# Altium project DTTT_Project.PrjPcb
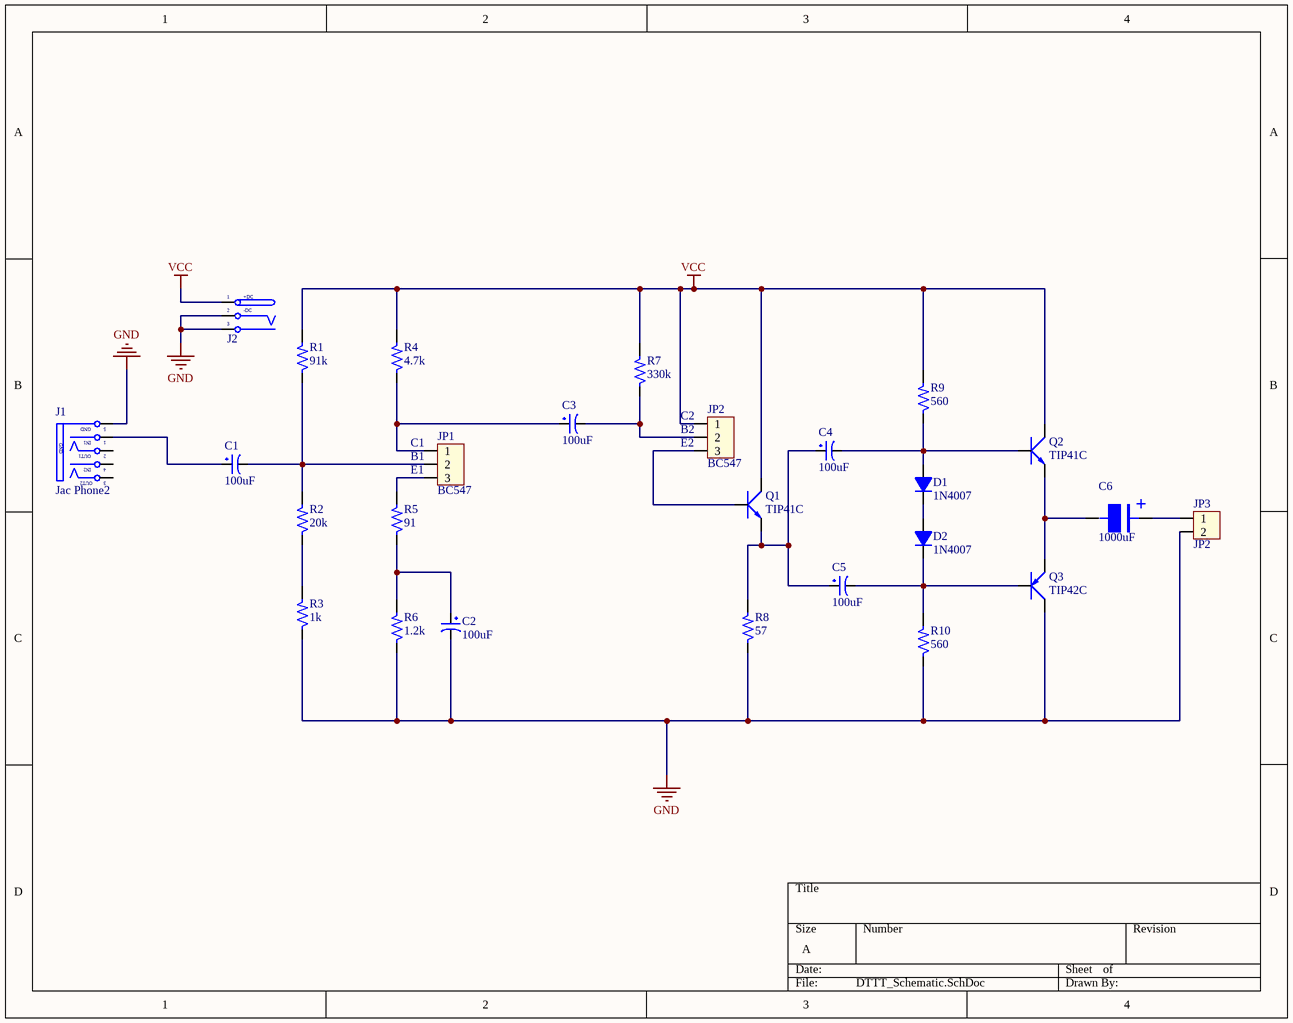
[diagram p0: DTTT_Schematic.SchDoc]
1 sheet, 26 parts. Net scope: global (net labels, ports and power ports of the same name join across sheets).
Board file: DTTT_PCB.PcbDoc

## Sheet DTTT_Schematic.SchDoc
size A; SheetNumber: 1; SheetTotal: 1

### Parts
C1  100uF  [CP1/2.5]
C2  100uF  [CP1/2.5]
C3  100uF  [CP1/2.5]
C4  100uF  [CP1/2.5]
C5  100uF  [CP1/2.5]
C6  1000uF  [CAP1000uF50V]
D1  1N4007  [D1A]
D2  1N4007  [D1A]
J1  Jac Phone2  [JacPhone2]
J2  JACK DC 5MM  [JACK DC 5MM]  (value not drawn)
JP1  BC547  [CON3]
JP2  BC547  [CON3]
JP3  JP2  [CON2]
Q1  TIP41C  [QTO-220]
Q2  TIP41C  [QTO-220]
Q3  TIP42C  [QTO-220]
R1  91k  [DIEN TRO 1/4 W]
R2  20k  [DIEN TRO 1/4 W]
R3  1k  [DIEN TRO 1/4 W]
R4  4.7k  [DIEN TRO 1/4 W]
R5  91  [DIEN TRO 1/4 W]
R6  1.2k  [DIEN TRO 1/4 W]
R7  330k  [DIEN TRO 1/4 W]
R8  57  [DIEN TRO 1/4 W]
R9  560  [DIEN TRO 1/4 W]
R10  560  [DIEN TRO 1/4 W]

### Nets
GND: C2.2 J1.5(GND) J2.2(TN) J2.3(S) JP3.2 Q3.2(C) R3.1 R6.1 R8.1 R10.1
VCC: J2.1(T) JP2.1 Q1.2(C) Q2.2(C) R1.2 R4.2 R7.2 R9.2
NetC1_1: C1.1 J1.1(S1)
NetC1_2: C1.2 JP1.2 R1.1 R2.2
NetC2_1: C2.1 R5.1 R6.2
NetC3_1: C3.1 JP1.1 R4.1
NetC3_2: C3.2 JP2.2 R7.1
NetC4_1: C4.1 C5.1 Q1.3(E) R8.2
NetC4_2: C4.2 D1.1(A) Q2.1(B) R9.1
NetC5_2: C5.2 D2.2(K) Q3.1(B) R10.2
NetC6_1: C6.1 JP3.1
NetC6_2: C6.2 Q2.3(E) Q3.3(E)
NetD1_2: D1.2(K) D2.1(A)
NetJP1_3: JP1.3 R5.2
NetJP2_3: JP2.3 Q1.1(B)
NetR2_1: R2.1 R3.2

Not connected (* = marked no-connect by the designer): J1 2(S1) 3(TN) 4(S)

### Notes on the sheet
- (near JP2) C2
- (near JP2) B2
- (near JP1) C1
- (near JP1) B1
- (near JP1) E1
- (near JP2) E2
- (in symbol Cap1000uF50V) +
- (in symbol Jac Phone2) IN1; OUT1; IN2; OUT2
- (in symbol JACK DC 5MM) +DC; -DC

### Library data of the parts
C1-C5 = CP2: C 47uF/50V , 220uF/16V; Value: 47uF/16 - 50V; Description 1: 470uF/6,3V - 330uF/10V - 220uF/16V; Description 2: 100uF/25V - 35V - 47uF/50V - 22uF/100V; Description 3: 33uF => 47uF/63V - 1uF => 4,7uF/160V; Description 4: 1uF => 2,2uF/250V - 1uF/350V
C6 = Cap1000uF50V: 1000uF: 1000uF
D1 D2 = D1A: Diode 1A; Value: 1N4007
J1 = Jac Phone2: Jac Phone Stereo; Creat by: VanDungEvn@Gmail.com
JP1 JP2 = Con3: Connector 3; Value: Connector 3
JP3 = CON2: Connector 2; Value: Connector 2
Q1 Q2 = TIP41C: NPN 2W, BCE; Value: TIP41C
Q3 = TIP42C: PNP 2W, BCE; Value: TIP42C
R1-R10 = Res: Resistor 1/4W; Value: R1/4W - 1K